# EAGLE design Xmas_base_board (EAGLE 9.6.2)
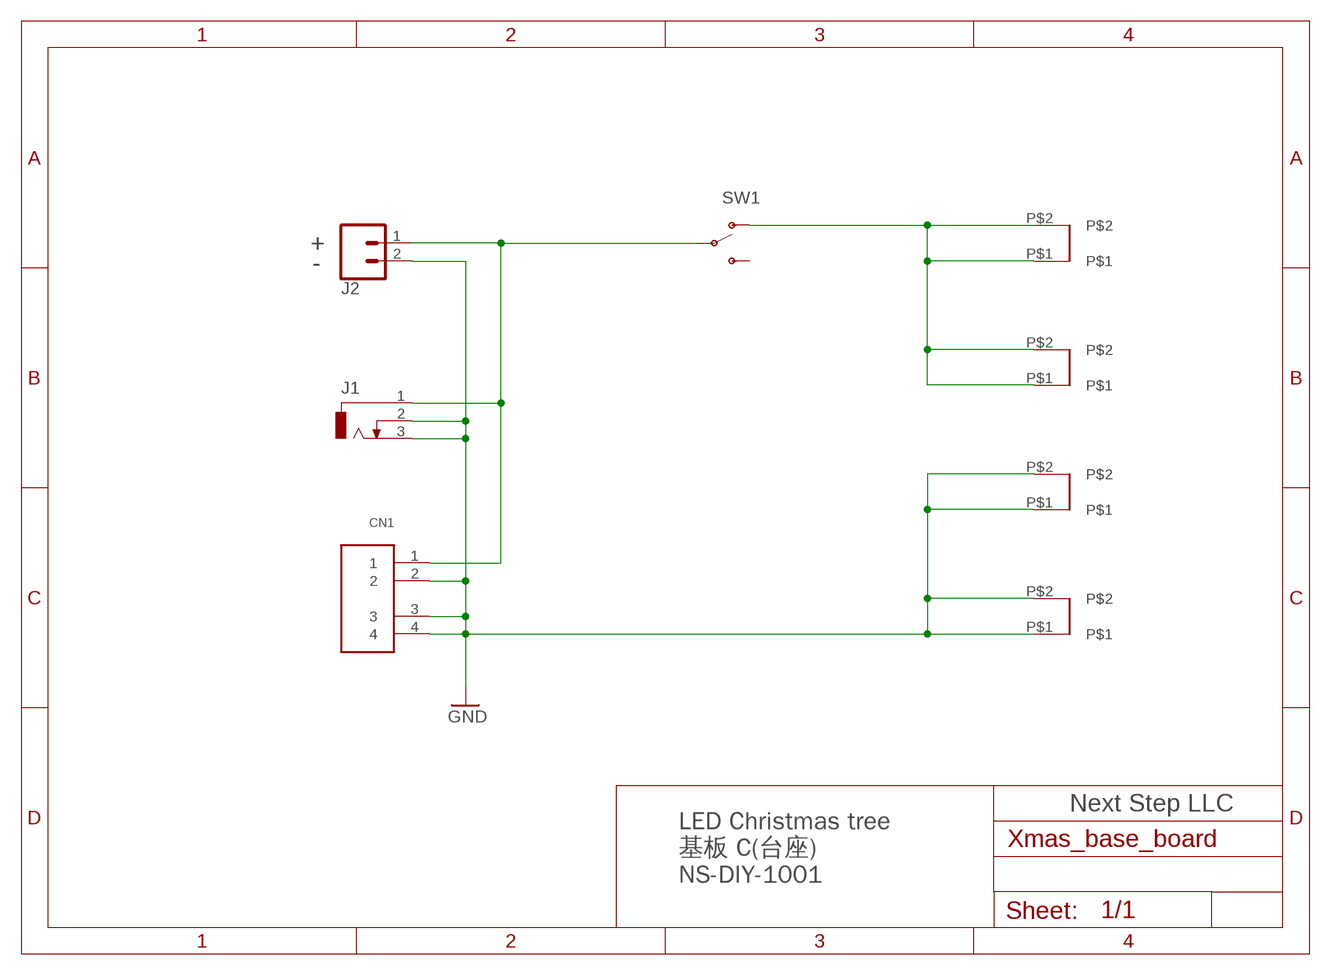
[diagram p0: schematic, sheet 1]

## Parts
CN1  MRUSB-2B-D14NI-S306_MRUSB-2B  [MRUSB-2B-D14NI-S306_MRUSB-2B]
J1  DCJ0303  [DCJ0303]
J2  CONN_02  [1X02]
SW1  SWITCH-SPDT-PTH-11.6X4.0MM  [SWITCH_SPDT_PTH_11.6X4.0MM]
U$5  XMAS-TREE  [XMAS-TREE]
U$6  XMAS-TREE  [XMAS-TREE]
U$7  XMAS-TREE  [XMAS-TREE]
U$8  XMAS-TREE  [XMAS-TREE]

## Nets
GND: CN1.2 CN1.3 CN1.4 J1.2 J1.3 J2.2 U$7.P$1 U$7.P$2 U$8.P$1 U$8.P$2
N$2: CN1.1 J1.1 J2.1 SW1.2(P)
N$3: SW1.1(O) U$5.P$1 U$5.P$2 U$6.P$1 U$6.P$2
Unconnected: SW1.3(S)

## Notes on the sheet
- +
- -
- Next Step LLC
- LED Christmas tree
  基板 C(台座)
  NS-DIY-1001

## Library data of the parts
CN1 = MRUSB-2B-D14NI-S306:MRUSB-2B-D14NI-S306_MRUSB-2B: Akizuki MRUSB-2B-D14NI-S306 C-10398
J1 = con-jack:DCJ0303: DC POWER JACK Source: DCJ0303.pdf; OC_FARNELL: unknown; OC_NEWARK: unknown
J2 = SparkFun-Connectors:CONN_02: Multi connection point. Often used as Generic Header-pin footprint for 0.1 inch spaced/style header connections On any of the 0.1 inch spaced packages, you can populate with these: Break Away Headers - Straight <https://www.sparkfun.com/products/116> (PRT-00116) Break Away Male Headers - Right Angle <https://www.sparkfun.com/products/553> (PRT-00553) Female Headers <https://www.sparkfun.com/products/115> (PRT-00115) Break Away Headers - Machine Pin <https://www.sparkfun.com/products/117> (PRT-00117) Break Away Female Headers - Swiss Machine Pin <https://www.sparkfun.com/products/743> (PRT-00743) For SCREWTERMINALS and SPRING TERMINALS visit here: Screw Terimnals on SparkFun.com <https://www.sparkfun.com/search/results?term=Screw+Terminals> (5mm/3.5mm/2.54mm spacing) This device is also useful as a general connection point to wire up your design to another part of your project. Our various solder wires solder well into these plated through hole pads. Hook-Up Wire - Assortment (Stranded, 22 AWG) <https://www.sparkfun.com/products/11375> (PRT-11375) Hook-Up Wire - Assortment (Solid Core, 22 AWG) <https://www.sparkfun.com/products/11367> (PRT-11367) View the entire wire category on our website here <https://www.sparkfun.com/categories/141> Special notes: Molex polarized connector foot print use with: PRT-08233 with associated crimp pins and housings. 2.54_SCREWTERM for use with PRT-10571. 3.5mm Screw Terminal footprints for PRT-08084 5mm Screw Terminal footprints for use with PRT-08432
SW1 = SparkFun-Switches:SWITCH-SPDT: Single Pole, Double Throw (SPDT) Switch Single-pole, double-throw (SPDT) switch. Variant Overview SMD-AYZ0202 Surface Mount DPDT Switch <https://www.sparkfun.com/products/597> (COM-00597) Used on e.g. LilyPad Arduino USB - ATmega32U4 Board <https://www.sparkfun.com/products/12049> PTH-11.6X4.0MM SPDT Mini Power Switch <https://www.sparkfun.com/products/102> (COM-00102) Used on e.g. SparkFun Simon Says - Through-Hole Soldering Kit <https://www.sparkfun.com/products/10547> (KIT-10547) PTH-11.6X4.0MM-KIT KIT version of SPDT Mini Power Switch - Simplifies soldering by removing tStop of switch pins - only one side can be soldered. PTH-11.6X4.0MM-LOCK LOCK version of SPDT Mini Power Switch - Offset pins hold switch in place for easier soldering. SMD-RIGHT-ANGLE Surface Mount Right Angle Switch <https://www.sparkfun.com/products/10860> (COM-10860) Used on e.g. SparkFun ESP8266 Thing <https://www.sparkfun.com/products/13231>; PROD_ID: SWCH-08261; SF_SKU: COM-00102
U$5-U$8 = xmas:XMAS-TREE

## Board
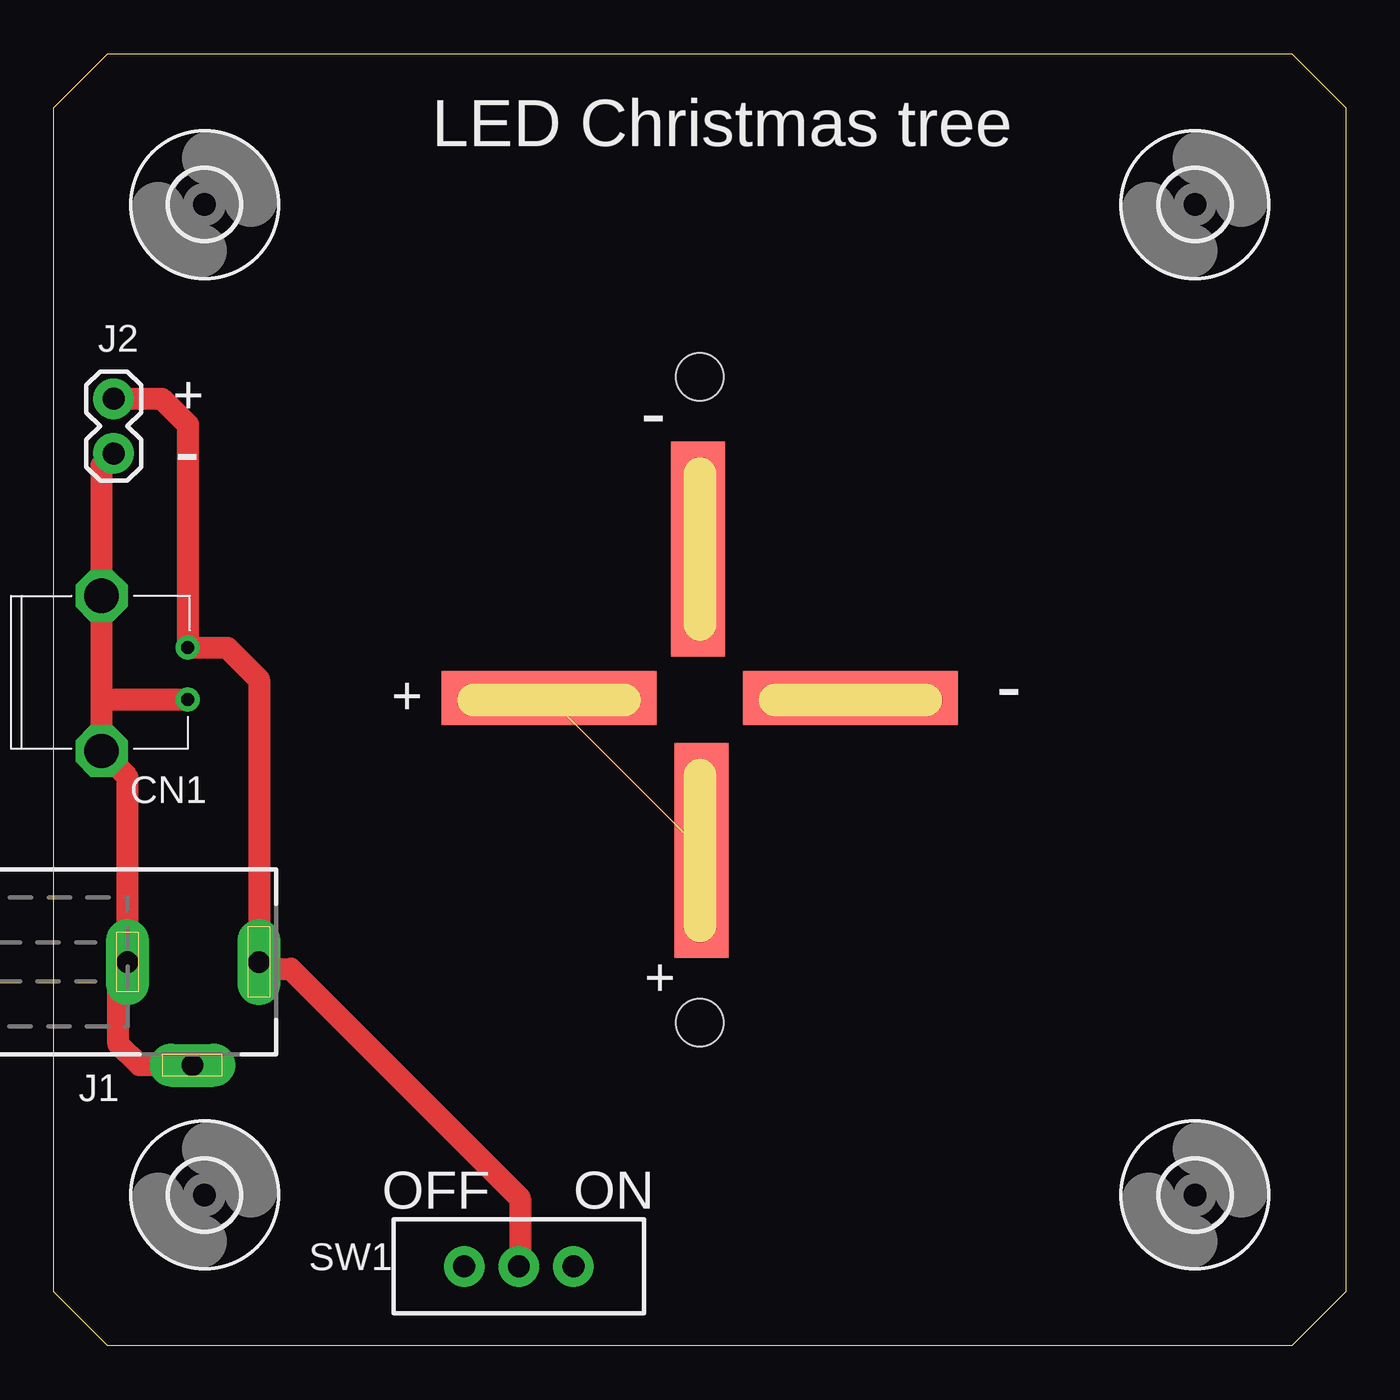
[diagram p1: board, top side]
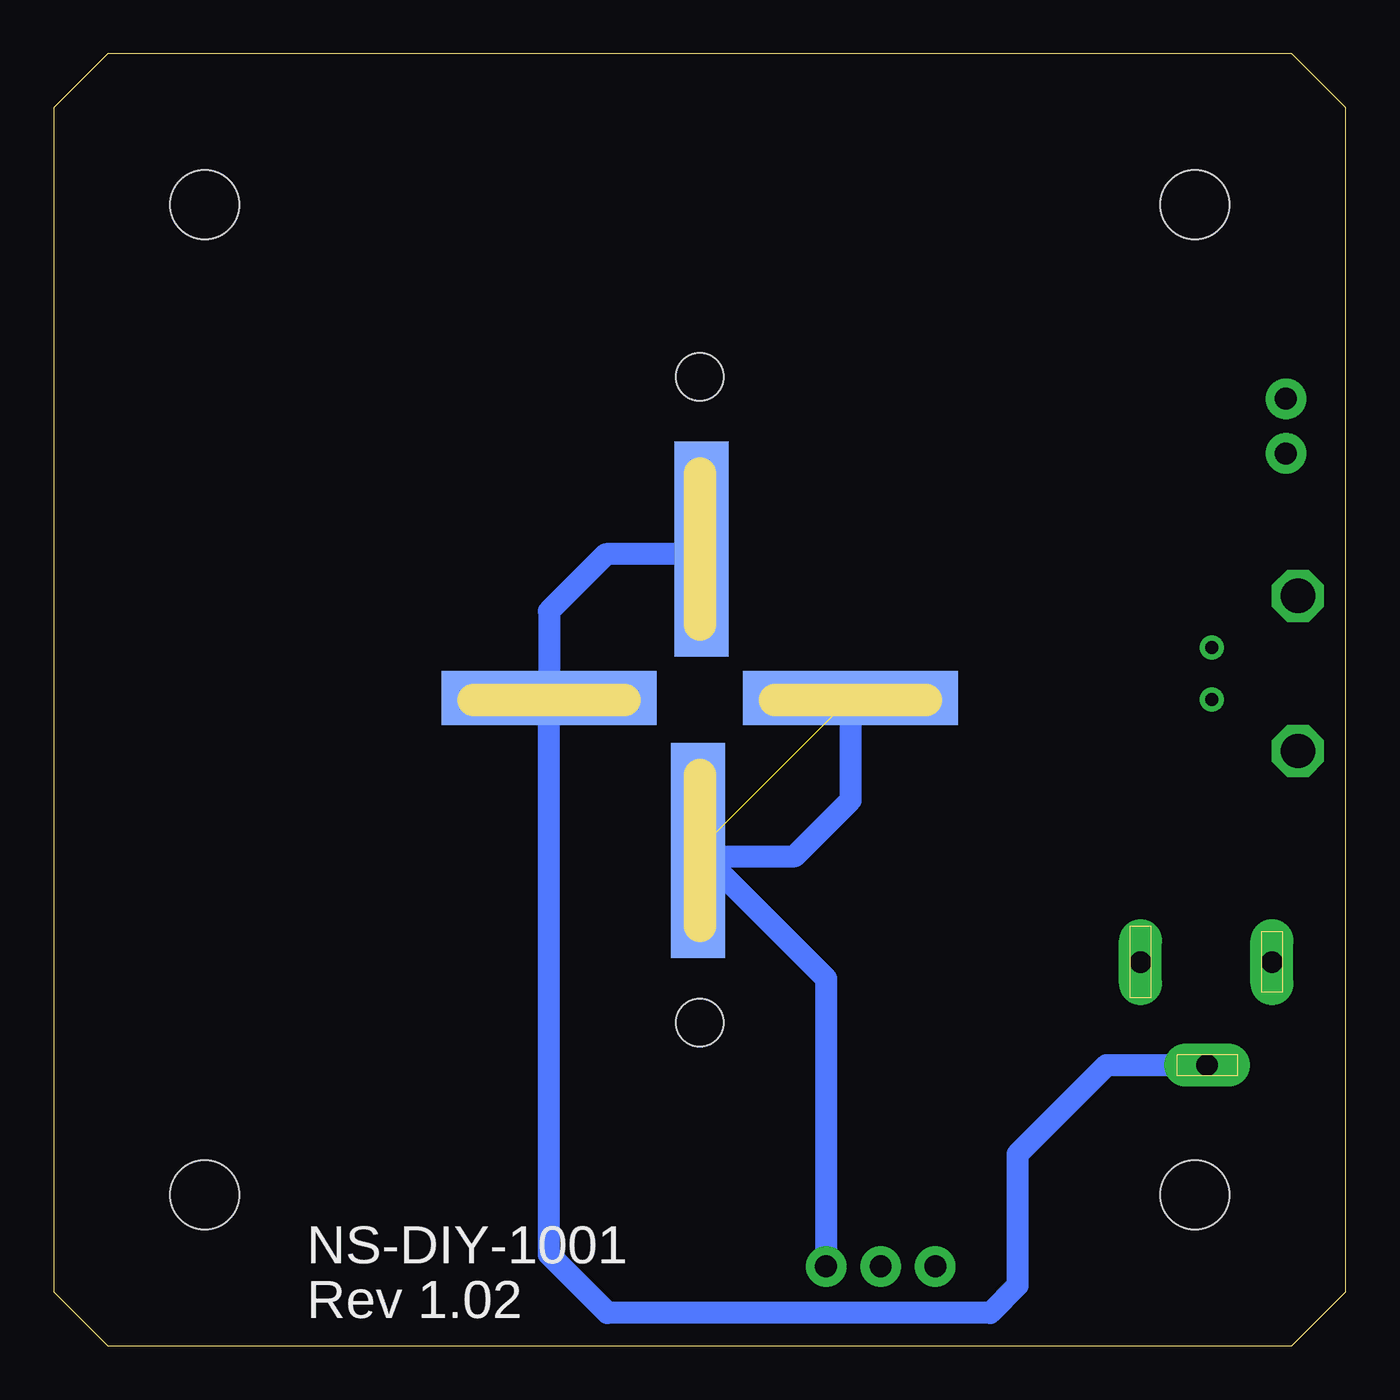
[diagram p2: board, bottom side, seen from below]

Size 60 x 60 mm. Coordinates in mm from the lower left corner, seen from the top.
Outline: 0,57.5 2.5,60 57.5,60 60,57.5 60,2.5 57.5,0 2.5,0 0,2.5 0,57.5
Copper layers (1*16): Top 0.035mm / dielectric 1.5mm / Bottom 0.035mm
Design rules "default": minimum track width 6mil, minimum drill 0.35mm, track to track 6mil, track to pad 6mil, pad to pad 6mil, via to via 6mil, smd to smd 6mil, copper to edge 40mil, drill to drill 6mil, minimum pad ring 10mil, minimum via ring 8mil, stop-mask expansion 4mil, vias tented up to drill 0mil, thermal gap 10mil
Holes 2.2 mm at 30,45 30,15

### Footprints (pad centres in the part's own frame; a part is rotated, then mirrored left to right if it is on the bottom)
MRUSB-2B-D14NI-S306_MRUSB-2B = drill 0.6: 1 1.2,0; 2 -1.2,0 | drill 1.6 octagon: 3 3.6,4; 4 -3.6,4
DCJ0303 = drill 1 pad 2 long: 1 0,3.1; 2 4.8,0; 3 0,-3
1X02 = drill 1.016 pad 1.88: 1 0,0; 2 2.54,0
SWITCH_SPDT_PTH_11.6X4.0MM = drill 1.016 pad 1.88: 1 0,2.54; 2 0,0; 3 0,-2.54
3,2 = hole 3.2: 0,0
XMAS-TREE = smd 10 x 2.5: P$1 0,0.08 | smd 10 x 2.5 bottom: P$2 0,0.08

### Placement (x,y rotation side)
CN1  6.22,31.22 90 top
J1  6.43,17.82 270 top
J2  2.78,43.98 270 top
SW1  21.6,3.69 270 top
U$1  [3,2]  7,53 0 top
U$2  [3,2]  53,53 0 top
U$3  [3,2]  7,7 0 top
U$4  [3,2]  53,7 0 top
U$5  23,30 0 top
U$6  30,23 270 top
U$7  37,30 0 top
U$8  30,37 90 top

### Tracks (layer width: path | path; a pad name or v marks a point on that pad's centre or on a via)
GND  (3 unrouted)
  Top 1.016: J1.2 3.98,13.02 3,14 3,17.39 J1.3 3.43,26.41 CN1.4 2.22,30 | 2.22,30 CN1.3 2.22,40.88 J2.2 | CN1.2 6.2,30 2.22,30
  Bottom 1.016: 30.15,36.77 34.35,36.77 37,34.12 U$7.P$1 37,4.23 34.29,1.52 16.51,1.52 15.24,2.79 15.24,8.89 11.11,13.02 J1.2
N$2
  Top 1.016: J2.1 5.02,43.98 6.22,42.78 CN1.1 8.06,32.42 9.53,30.95 J1.1 9.85,17.5 11,17.5 21.65,6.85 21.65,3.74 SW1.2
N$3  (3 unrouted)
  Top 1.016: U$6.P$1 29.81,22.73
  Bottom 1.016: SW1.1 24.14,17.06 29.81,22.73 25.59,22.73 23,25.32 U$5.P$2

### Text on the board
tPlace: LED Christmas tree | + | - | - | + | - | + | OFF | ON
bPlace: NS-DIY-1001 | Rev 1.02